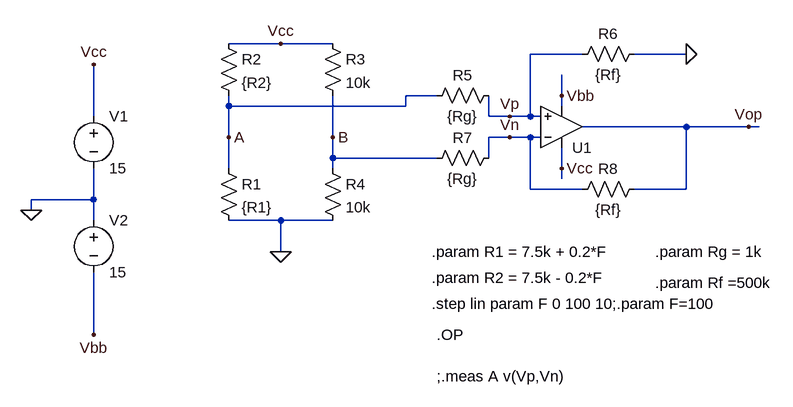
[diagram p0: schematic sensore push pull resistivo half bridge.asc]
sensore push pull resistivo half bridge.asc, the LTspice schematic file:
Version 4.1
SHEET 1 960 680
WIRE 176 64 96 64
WIRE 256 64 176 64
WIRE 640 80 560 80
WIRE 800 80 720 80
WIRE 416 144 368 144
WIRE 608 144 608 112
WIRE 96 160 96 144
WIRE 368 160 368 144
WIRE 368 160 96 160
WIRE 608 160 608 144
WIRE -112 176 -112 96
WIRE 496 176 496 144
WIRE 528 176 496 176
WIRE 560 176 560 80
WIRE 560 176 528 176
WIRE 576 176 560 176
WIRE 800 192 640 192
WIRE 896 192 800 192
WIRE 912 192 896 192
WIRE 96 208 96 160
WIRE 256 208 256 144
WIRE 528 208 496 208
WIRE 560 208 528 208
WIRE 576 208 560 208
WIRE 256 240 256 208
WIRE 416 240 256 240
WIRE 496 240 496 208
WIRE 96 256 96 208
WIRE 256 256 256 240
WIRE 608 256 608 224
WIRE 608 272 608 256
WIRE 560 288 560 208
WIRE 640 288 560 288
WIRE 800 288 800 192
WIRE 800 288 720 288
WIRE -112 304 -112 256
WIRE -112 304 -208 304
WIRE -208 320 -208 304
WIRE -112 336 -112 304
WIRE 176 336 96 336
WIRE 256 336 176 336
WIRE 176 384 176 336
WIRE -112 512 -112 416
FLAG 176 384 0
FLAG -208 320 0
FLAG -112 96 Vcc
FLAG 176 64 Vcc
FLAG 800 80 0
FLAG -112 512 Vbb
FLAG 608 144 Vbb
FLAG 608 256 Vcc
FLAG 896 192 Vop
FLAG 528 176 Vp
FLAG 528 208 Vn
FLAG 96 208 A
FLAG 256 208 B
DATAFLAG 784 192 ""
DATAFLAG 192 160 ""
DATAFLAG 320 240 ""
DATAFLAG -112 128 ""
DATAFLAG -112 448 ""
DATAFLAG 560 112 ""
DATAFLAG 560 272 ""
SYMBOL OpAmps\\UniversalOpAmp 608 192 M180
SYMATTR InstName U1
SYMBOL res 80 240 R0
SYMATTR InstName R1
SYMATTR Value {R1}
SYMBOL res 80 48 R0
SYMATTR InstName R2
SYMATTR Value {R2}
SYMBOL res 240 48 R0
SYMATTR InstName R3
SYMATTR Value 10k
SYMBOL res 240 240 R0
SYMATTR InstName R4
SYMATTR Value 10k
SYMBOL res 512 128 R90
WINDOW 0 0 56 VBottom 2
WINDOW 3 32 56 VTop 2
SYMATTR InstName R5
SYMATTR Value {Rg}
SYMBOL res 736 64 R90
WINDOW 0 0 56 VBottom 2
WINDOW 3 32 56 VTop 2
SYMATTR InstName R6
SYMATTR Value {Rf}
SYMBOL res 512 224 R90
WINDOW 0 0 56 VBottom 2
WINDOW 3 32 56 VTop 2
SYMATTR InstName R7
SYMATTR Value {Rg}
SYMBOL res 736 272 R90
WINDOW 0 0 56 VBottom 2
WINDOW 3 32 56 VTop 2
SYMATTR InstName R8
SYMATTR Value {Rf}
SYMBOL voltage -112 160 R0
WINDOW 123 0 0 Left 0
WINDOW 39 0 0 Left 0
SYMATTR InstName V1
SYMATTR Value 15
SYMBOL voltage -112 320 R0
WINDOW 123 0 0 Left 0
WINDOW 39 0 0 Left 0
SYMATTR InstName V2
SYMATTR Value 15
TEXT 408 384 Left 2 !.param R1 = 7.5k + 0.2*F
TEXT 408 424 Left 2 !.param R2 = 7.5k - 0.2*F
TEXT 408 464 Left 2 !.step lin param F 0 100 10;.param F=100
TEXT 416 512 Left 2 !.OP
TEXT 752 384 Left 2 !.param Rg = 1k
TEXT 752 432 Left 2 !.param Rf =500k
TEXT 416 576 Left 2 !;.meas A v(Vp,Vn)

The netlist it stands for:
* sensore push pull resistivo half bridge.asc
X§U1 Vp Vn Vcc Vbb Vop level1 Avol=1Meg GBW=10Meg Vos=0 En=0 Enk=0 In=0 Ink=0 Rin=500Meg  ; pins In+ In- V+ V- OUT
R1 A 0 {R1}
R2 Vcc A {R2}
R3 Vcc B 10k
R4 B 0 10k
R5 Vp A {Rg}
R6 0 Vp {Rf}
R7 Vn B {Rg}
R8 Vop Vn {Rf}
V1 Vcc 0 15
V2 0 Vbb 15
.param R1 = 7.5k + 0.2*F
.param R2 = 7.5k - 0.2*F
.step lin param F 0 100 10;.param F=100
.OP
.param Rg = 1k
.param Rf =500k
;.meas A v(Vp,Vn)
.lib UniversalOpAmp1.lib
.backanno
.end